# Altium schematic sheet DSO_RAM.SchDoc: Schematic_Name
size A4; CompanyName: University of Melbourne; Engineer: Your Name Here; DocumentNumber: 1; Revision: 0.1; SheetNumber: 1; SheetTotal: 1; Title_Project: Project_Title; StudentNo: Student No.
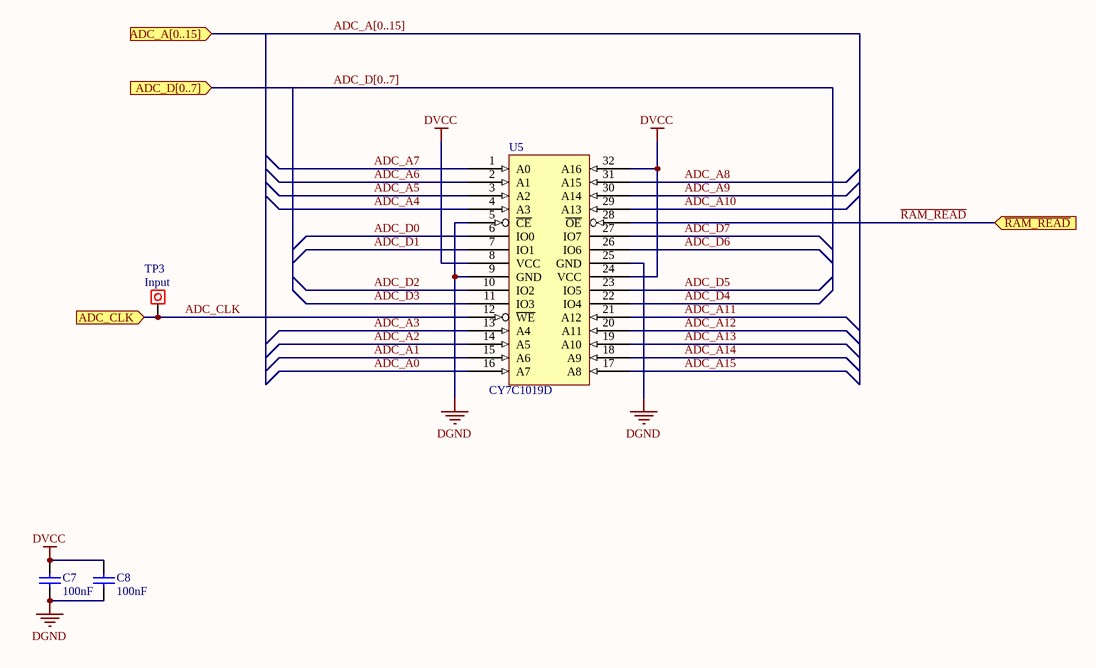
[diagram p0: DSO_RAM.SchDoc]

## Parts
C7  100nF  [0805C]
C8  100nF  [0805C]
TP3  INPUT  [Testpoin]
U5  CY7C1019D  [TSOP-32]

## Ports
ADC_A[0..15] (in), ADC_CLK (in), ADC_D[0..7] (in), ~{RAM_READ} (in)

## Nets
DGND: C7.2 C8.2 U5.5(~{CE}) U5.9(GND) U5.25(GND)
DVCC: C7.1 C8.1 U5.8(VCC) U5.24(VCC) U5.32(A16)
ADC_A0: U5.16(A7)
ADC_A1: U5.15(A6)
ADC_A2: U5.14(A5)
ADC_A3: U5.13(A4)
ADC_A4: U5.4(A3)
ADC_A5: U5.3(A2)
ADC_A6: U5.2(A1)
ADC_A7: U5.1(A0)
ADC_A8: U5.31(A15)
ADC_A9: U5.30(A14)
ADC_A10: U5.29(A13)
ADC_A11: U5.21(A12)
ADC_A12: U5.20(A11)
ADC_A13: U5.19(A10)
ADC_A14: U5.18(A9)
ADC_A15: U5.17(A8)
ADC_CLK: TP3.1 U5.12(~{WE}) ; port ADC_CLK
ADC_D0: U5.6(IO0)
ADC_D1: U5.7(IO1)
ADC_D2: U5.10(IO2)
ADC_D3: U5.11(IO3)
ADC_D4: U5.22(IO4)
ADC_D5: U5.23(IO5)
ADC_D6: U5.26(IO6)
ADC_D7: U5.27(IO7)
~{RAM_READ}: U5.28(~{OE}) ; port ~{RAM_READ}

## Buses and harness runs
bus ADC_A[0..15] = port ADC_A[0..15]
bus ADC_D[0..7] = port ADC_D[0..7]

## Library data of the parts
C7 C8 = C: Capacitor; Reviewed by: RM - 2018/08/05; Revision: July-2002: Re-released for DXP Platform.; Value: 100nF; Supplier 1: *; Supplier Part Number 1: *
TP3 = Test Point: Pad; Value: Input
U5 = CY7C1019D: SRAM 128k x 8; Reviewed by: RM - 2018/08/05; Supplier 1: Digi-Key; Supplier Part Number 1: 428-1967-ND